# Altium schematic sheet middle.SchDoc
size A; SheetNumber: 1; SheetTotal: 1
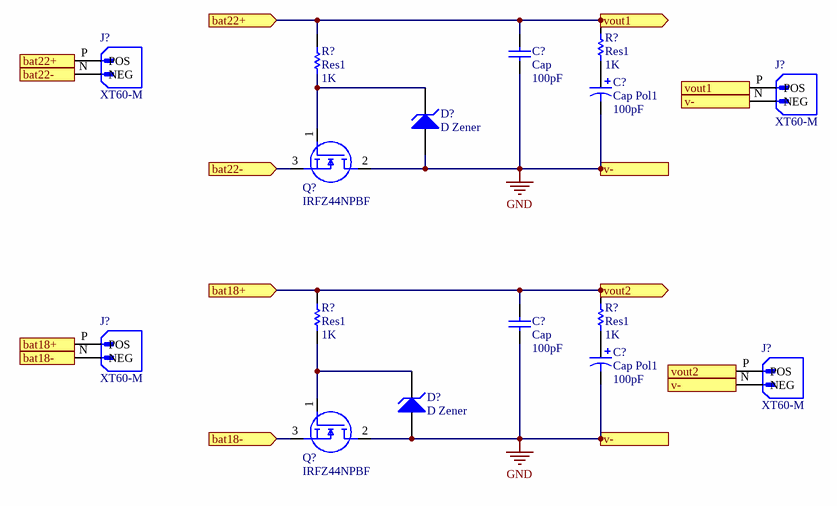
[diagram p0: middle.SchDoc]

## Parts
(Parts that share a designator on the sheet are numbered #1, #2 ... from top to bottom, then left to right.)
C?#1  Cap  value 100pF  [RAD-0.3]
C?#2  Cap Pol1  value 100pF  [RB7.6-15]
C?#3  Cap  value 100pF  [RAD-0.3]
C?#4  Cap Pol1  value 100pF  [RB7.6-15]
D?#1  D Zener  [DIODE-0.7]
D?#2  D Zener  [DIODE-0.7]
J?#1  XT60-M  [AMASS_XT60-M]
J?#2  XT60-M  [AMASS_XT60-M]
J?#3  XT60-M  [AMASS_XT60-M]
J?#4  XT60-M  [AMASS_XT60-M]
Q?#1  IRFZ44NPBF  [TO254P483X1016X1994-3P]
Q?#2  IRFZ44NPBF  [TO254P483X1016X1994-3P]
R?#1  Res1  value 1K  [AXIAL-0.3]
R?#2  Res1  value 1K  [AXIAL-0.3]
R?#3  Res1  value 1K  [AXIAL-0.3]
R?#4  Res1  value 1K  [AXIAL-0.3]

## Ports
bat18+ (in), bat18- (in), bat22+ (in), bat22- (in), v- (out), vout1 (out), vout2 (out)

## Nets
GND: C?#1.1 C?#2.2 C?#3.1 C?#4.2 D?#1.1(A) D?#2.1(A) J?#2.N(NEG) J?#4.N(NEG) Q?#1.2(D) Q?#2.2(D) ; port v-
bat18+: C?#3.2 J?#3.P(POS) J?#4.P(POS) R?#3.1 R?#4.2 ; port bat18+, port vout2
bat18-: J?#3.N(NEG) Q?#2.3(S) ; port bat18-
bat22+: C?#1.2 J?#1.P(POS) J?#2.P(POS) R?#1.2 R?#2.2 ; port bat22+, port vout1
bat22-: J?#1.N(NEG) Q?#1.3(S) ; port bat22-
NetC?#2_1: C?#2.1 R?#1.1
NetC?#4_1: C?#4.1 R?#4.1
NetD?#1_2: D?#1.2(K) Q?#1.1(G) R?#2.1
NetD?#2_2: D?#2.2(K) Q?#2.1(G) R?#3.2

## Library data of the parts
C?#1 C?#3 = Cap: Capacitor; Published: 8-Jun-2000; LatestRevisionDate: 17-Jul-2002; LatestRevisionNote: Re-released for DXP Platform.; PackageReference: RAD-0.3; Publisher: Altium Limited; PackageDescription: Radial Cap, Thru-Hole; 2 Leads; 0.3 in Pin Spacing
C?#2 C?#4 = Cap Pol1: Polarized Capacitor (Radial); Published: 8-Jun-2000; LatestRevisionDate: 17-Jul-2002; LatestRevisionNote: Re-released for DXP Platform.; PackageReference: RB7.6-15; Publisher: Altium Limited; PackageDescription: Polarized Capacitor (Radial); 2 Leads
D?#1 D?#2 = D Zener: Zener Diode; Published: 8-Jun-2000; LatestRevisionDate: 17-Jul-2002; LatestRevisionNote: Re-released for DXP Platform.; PackageReference: DIODE-0.7; Publisher: Altium Limited; PackageDescription: Diode, Thru-Hole; 2 Leads; 0.7 in Pin Spacing
J?#1-J?#4 = XT60-M: Plug; DC supply; XT60; male; PIN: 2; for cable; soldered; 30A; 500V; MF: AMASS; Package: Package; Availability: Not in stock; SnapEDA_Link: https://www.snapeda.com/parts/XT60-M/AMASS/view-part/?ref=snap; Check_prices: https://www.snapeda.com/parts/XT60-M/AMASS/view-part/?ref=eda; MP: XT60-M; Price: None; Value: *
Q?#1 Q?#2 = IRFZ44NPBF: MOSFET (N-Channel); Manufacturer_Name: Infineon; Datasheet Link: https://www.infineon.com/dgdl/irfz44npbf.pdf?fileId=5546d462533600a40153563b3a9f220d; Height: 4.83mm; Manufacturer_Part_Number: IRFZ44NPBF; Mouser Part Number: 942-IRFZ44NPBF; Mouser Price/Stock: https://www.mouser.co.uk/ProductDetail/Infineon-IR/IRFZ44NPBF?qs=9%252BKlkBgLFf24zghzPg2f9g%3D%3D; Arrow Part Number: IRFZ44NPBF; Arrow Price/Stock: https://www.arrow.com/en/products/irfz44npbf/infineon-technologies-ag?region=nac
R?#1-R?#4 = Res1: Resistor; Published: 8-Jun-2000; LatestRevisionDate: 17-Jul-2002; LatestRevisionNote: Re-released for DXP Platform.; PackageReference: AXIAL-0.3; Publisher: Altium Limited; PackageDescription: Axial Device, Thru-Hole; 2 Leads; 0.3 in Pin Spacing